# Altium schematic sheet s&h.SchDoc
size Letter
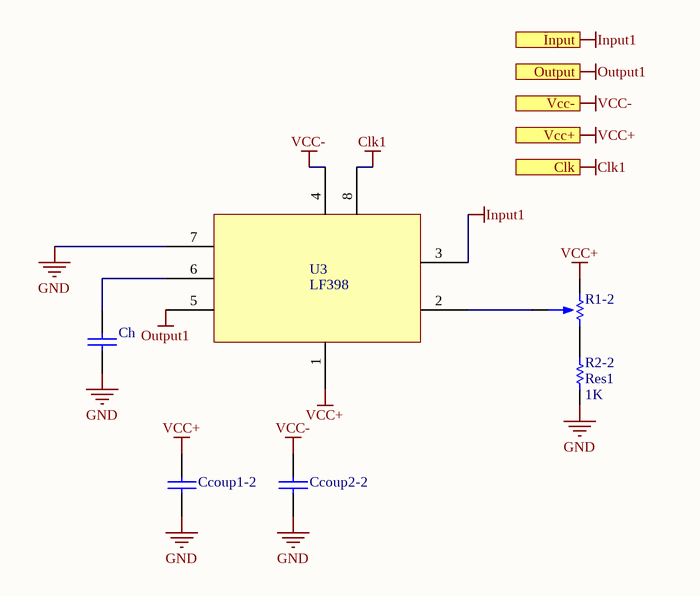
[diagram p0: s&h.SchDoc]

## Parts
Ccoup1-2  CAP  [CAP200]  (value not drawn)
Ccoup2-2  CAP  [CAP200]  (value not drawn)
Ch  CAP  [CAP200]  (value not drawn)
R1-2  PRESET  [PRESET V]  (value not drawn)
R2-2  Res1  value 1K  [AXIAL-0.3]
U3  LF398  [DIP8]

## Ports
Clk, Input, Output, Vcc+, Vcc-

## Nets
Clk1: U3.8(VCC) ; port Clk
GND: Ccoup1-2.2 Ccoup2-2.2 Ch.2 R2-2.1 U3.7(DISCHARGE)
Input1: U3.3(OUT) ; port Input
Output1: U3.5(C_VOLTAJE) ; port Output
VCC+: Ccoup1-2.1 R1-2.3 U3.1(GND) ; port Vcc+
VCC-: Ccoup2-2.1 U3.4(RESET) ; port Vcc-
NetCh_1: Ch.1 U3.6(THRESHOLD)
NetR1-2_1: R1-2.1 R2-2.2
NetR1-2_2: R1-2.2 U3.2(TRIGGER)

## Library data of the parts
R2-2 = Res1: Resistor; Published: 8-Jun-2000; LatestRevisionDate: 17-Jul-2002; LatestRevisionNote: Re-released for DXP Platform.; PackageReference: AXIAL-0.3; Publisher: Altium Limited; PackageDescription: Axial Device, Thru-Hole; 2 Leads; 0.3 in Pin Spacing
U3 = LM555: Sample and Hold Amplifier